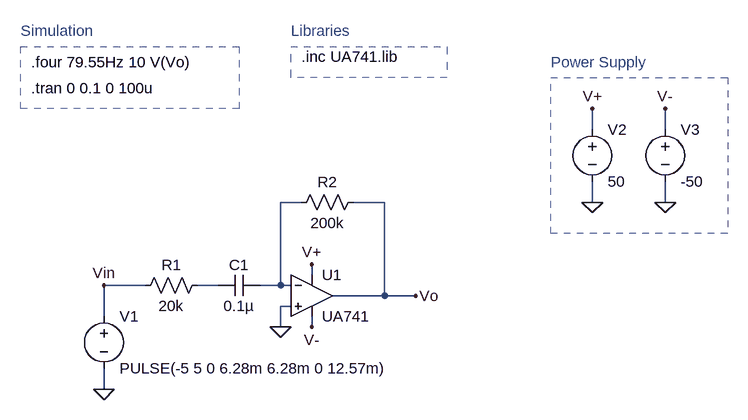
[diagram p0: schematic Other_Example_1.asc]
Other_Example_1.asc, the LTspice schematic file:
Version 4
SHEET 1 1900 680
WIRE 1056 -32 1056 -64
WIRE 1168 -32 1168 -64
WIRE 608 80 576 80
WIRE 736 80 688 80
WIRE 1056 80 1056 48
WIRE 1168 80 1168 48
WIRE 624 192 624 176
WIRE 368 208 304 208
WIRE 480 208 448 208
WIRE 576 208 576 80
WIRE 576 208 544 208
WIRE 592 208 576 208
WIRE 736 224 736 80
WIRE 736 224 656 224
WIRE 784 224 736 224
WIRE 592 240 576 240
WIRE 304 256 304 208
WIRE 576 272 576 240
WIRE 624 272 624 256
WIRE 304 368 304 336
FLAG 1056 80 0
FLAG 1168 80 0
FLAG 1056 -64 V+
FLAG 1168 -64 V-
FLAG 624 176 V+
FLAG 624 272 V-
FLAG 576 272 0
FLAG 304 368 0
FLAG 784 224 Vo
FLAG 304 208 Vin
SYMBOL voltage 304 240 R0
WINDOW 123 0 0 Left 0
WINDOW 39 0 0 Left 0
SYMATTR InstName V1
SYMATTR Value PULSE(-5 5 0 6.28m 6.28m 0 12.57m)
SYMBOL res 464 192 R90
WINDOW 0 0 56 VBottom 2
WINDOW 3 32 56 VTop 2
SYMATTR InstName R1
SYMATTR Value 20k
SYMBOL cap 544 192 R90
WINDOW 0 0 32 VBottom 2
WINDOW 3 32 32 VTop 2
SYMATTR InstName C1
SYMATTR Value 0.1µ
SYMBOL res 704 64 R90
WINDOW 0 0 56 VBottom 2
WINDOW 3 32 56 VTop 2
SYMATTR InstName R2
SYMATTR Value 200k
SYMBOL OpAmps\\opamp2 624 160 R0
SYMATTR InstName U1
SYMATTR Value UA741
SYMBOL voltage 1056 -48 R0
SYMATTR InstName V2
SYMATTR Value 50
SYMBOL voltage 1168 -48 R0
SYMATTR InstName V3
SYMATTR Value -50
TEXT 192 -136 Left 2 !.four 79.55Hz 10 V(Vo)
TEXT 192 -96 Left 2 !.tran 0 0.1 0 100u
TEXT 608 -144 Left 2 !.inc UA741.lib
TEXT 176 -184 Left 2 ;Simulation
TEXT 592 -184 Left 2 ;Libraries
TEXT 992 -136 Left 2 ;Power Supply
RECTANGLE Normal 512 -64 176 -160 2
RECTANGLE Normal 832 -112 592 -160 2
RECTANGLE Normal 1264 128 992 -112 2

The netlist it stands for:
* Other_Example_1.asc
V1 Vin 0 PULSE(-5 5 0 6.28m 6.28m 0 12.57m)
R1 N002 Vin 20k
C1 N001 N002 0.1µ
R2 Vo N001 200k
XU1 0 N001 V+ V- Vo UA741  ; pins In+ In- V+ V- OUT
V2 V+ 0 50
V3 V- 0 -50
.four 79.55Hz 10 V(Vo)
.tran 0 0.1 0 100u
.inc UA741.lib
* Simulation
* Libraries
* Power Supply
.backanno
.end